# EAGLE design untitled (EAGLE 7.2.0)
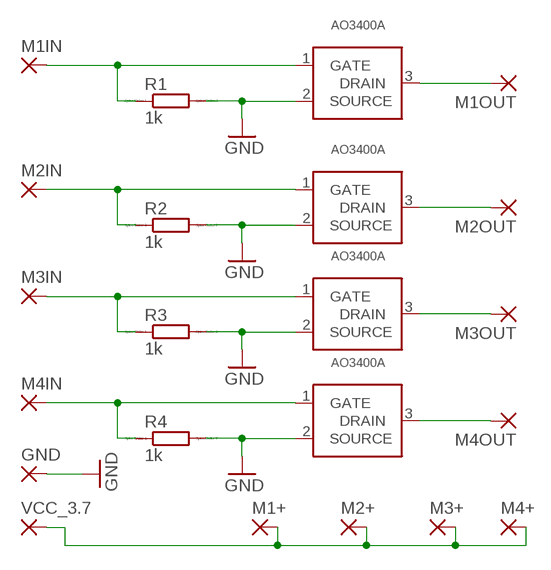
[diagram p0: schematic, sheet 1]

## Parts
GND  SMD2  [SMD1,27-2,54]
M1+  SMD2  [SMD1,27-2,54]
M1IN  SMD2  [SMD1,27-2,54]
M1OUT  SMD2  [SMD1,27-2,54]
M2+  SMD2  [SMD1,27-2,54]
M2IN  SMD2  [SMD1,27-2,54]
M2OUT  SMD2  [SMD1,27-2,54]
M3+  SMD2  [SMD1,27-2,54]
M3IN  SMD2  [SMD1,27-2,54]
M3OUT  SMD2  [SMD1,27-2,54]
M4+  SMD2  [SMD1,27-2,54]
M4IN  SMD2  [SMD1,27-2,54]
M4OUT  SMD2  [SMD1,27-2,54]
R1  1k  RR1206  [R1206]
R2  1k  RR1206  [R1206]
R3  1k  RR1206  [R1206]
R4  1k  RR1206  [R1206]
U$1  AO3400A  [SOT-23]
U$2  AO3400A  [SOT-23]
U$3  AO3400A  [SOT-23]
U$4  AO3400A  [SOT-23]
VCC_3.7  SMD2  [SMD1,27-2,54]

## Nets
GND: GND.1(P) R1.2 R2.2 R3.2 R4.2 U$1.2(SOURCE) U$2.2(SOURCE) U$3.2(SOURCE) U$4.2(SOURCE)
M1OUT: M1OUT.1(P) U$1.3(DRAIN)
N$1: M1IN.1(P) R1.1 U$1.1(GATE)
N$2: M4IN.1(P) R4.1 U$4.1(GATE)
N$3: M2IN.1(P) R2.1 U$2.1(GATE)
N$4: M3IN.1(P) R3.1 U$3.1(GATE)
N$5: M1+.1(P) M2+.1(P) M3+.1(P) M4+.1(P) VCC_3.7.1(P)
N$6: M2OUT.1(P) U$2.3(DRAIN)
N$7: M3OUT.1(P) U$3.3(DRAIN)
N$8: M4OUT.1(P) U$4.3(DRAIN)

## Library data of the parts
GND M1+ M1IN M1OUT M2+ M2IN M2OUT M3+ M3IN M3OUT M4+ M4IN M4OUT VCC_3.7 = wirepad:SMD2: SMD PAD
R1-R4 = eagle-ltspice:R: RESISTOR, European symbol; SPICEMODEL: NONE; SPICEPREFIX: R
U$1-U$4 = smd-footprints:AO3400A

## Board
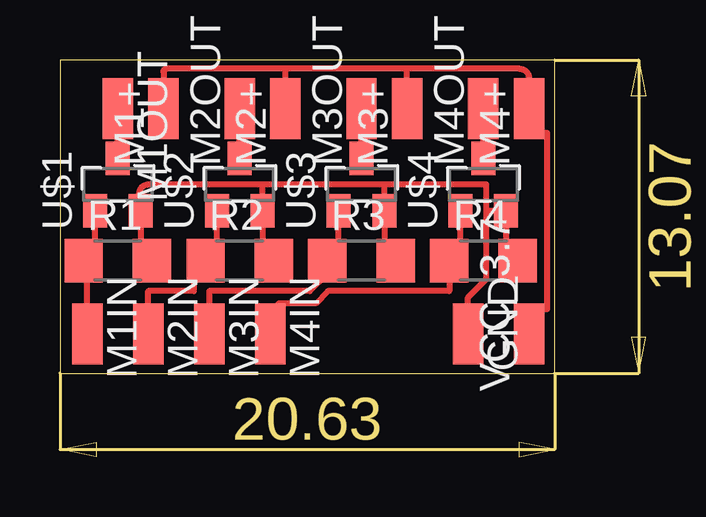
[diagram p1: board, top side]

Size 20.63 x 13.07 mm. Coordinates in mm from the lower left corner, seen from the top.
Outline: 0,0 20.63,0 20.63,13.07 0,13.07 0,0
Copper layers (1*16): Top 0.035mm / dielectric 1.5mm / Bottom 0.035mm
Design rules "default": minimum track width 10mil, minimum drill 24mil, track to track 8mil, track to pad 8mil, pad to pad 8mil, via to via 8mil, smd to smd 8mil, copper to edge 40mil, drill to drill 8mil, minimum pad ring 10mil, minimum via ring 8mil, stop-mask expansion 4mil, vias tented up to drill 0mil, thermal gap 10mil

### Footprints (pad centres in the part's own frame; a part is rotated, then mirrored left to right if it is on the bottom)
SMD1,27-2,54 = smd 1.27 x 2.54: 1 0,0
R1206 = smd 1.6 x 1.803: 1 -1.422,0; 2 1.422,0
SOT-23 = smd 1 x 1.4: 1 -0.95,-1.1; 2 0.95,-1.1; 3 0,1.1

### Placement (x,y rotation side)
GND  17.02,1.65 180 top
M1+  4.32,11.05 0 top
M1IN  1.14,1.65 180 top
M1OUT  2.41,11.05 180 top
M2+  9.4,11.05 0 top
M2IN  3.68,1.65 180 top
M2OUT  7.49,11.05 0 top
M3+  14.48,11.05 0 top
M3IN  6.22,1.65 180 top
M3OUT  12.57,11.05 0 top
M4+  19.56,11.05 0 top
M4IN  8.76,1.65 180 top
M4OUT  17.65,11.05 0 top
R1  2.41,4.7 0 top
R2  7.49,4.7 0 top
R3  12.57,4.7 0 top
R4  17.65,4.7 0 top
U$1  2.41,7.87 0 top
U$2  7.49,7.87 0 top
U$3  12.57,7.87 0 top
U$4  17.65,7.87 0 top
VCC_3.7  19.56,1.65 0 top

### Tracks (layer width: path | path; a pad name or v marks a point on that pad's centre or on a via)
GND
  Top 0.254: GND.1 17.02,3.18 17.78,3.94 17.78,6.73 | 17.78,6.73 17.78,7.87 13.46,7.87 | 13.46,7.87 8.38,7.87 | 8.38,7.87 3.68,7.87 arc90 3.3,7.49 3.3,6.84 U$1.2 3.36,5.17 R1.2 | 8.38,7.87 8.44,7.81 U$2.2 8.44,5.17 R2.2 | 13.46,7.87 13.52,7.81 U$3.2 13.52,5.17 R3.2 | R4.2 18.6,5.17 U$4.2 17.82,6.77 17.78,6.73
M1OUT
  Top 0.254: U$1.3 M1OUT.1
N$1
  Top 0.254: U$1.1 1.46,4.7 R1.1 1.14,4.55 M1IN.1
N$2
  Top 0.254: U$4.1 16.7,4.7 R4.1 16.23,3.43 11.18,3.43 10.67,2.92 9.14,2.92 8.76,2.54 M4IN.1
N$3
  Top 0.254: U$2.1 6.54,4.7 R2.1 6.07,3.94 5.59,3.94 5.59,3.43 3.68,3.43 M2IN.1
N$4
  Top 0.254: U$3.1 11.62,4.7 R3.1 11.15,4.17 10.41,3.43 6.22,3.43 M3IN.1
N$5
  Top 0.254: VCC_3.7.1 19.56,2.67 20.32,2.67 20.32,10.03 19.56,10.03 M4+.1 19.56,12.32 arc90 19.18,12.7 14.48,12.7 | 14.48,12.7 9.4,12.7 | 9.4,12.7 4.45,12.7 arc90 4.32,12.57 M1+.1 | M2+.1 9.4,12.7 | M3+.1 14.48,12.7
N$6
  Top 0.254: U$2.3 M2OUT.1
N$7
  Top 0.254: U$3.3 M3OUT.1
N$8
  Top 0.254: U$4.3 M4OUT.1